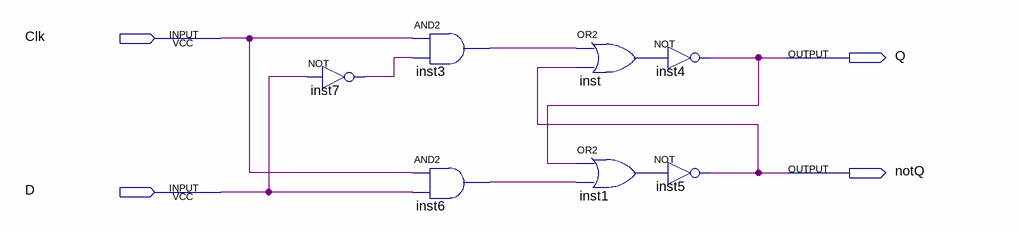
[diagram p0: schematic sheet]
// Quartus schematic DLatch1.bdf as structural Verilog: 7 symbols, 4 pins
module DLatch1 (
  input  Clk,
  input  D,
  output Q,
  output notQ
);

  wire inst1_out, inst3_out, inst6_out, inst7_out, inst_out;

  not inst7 (inst7_out, D);
  and inst3 (inst3_out, Clk, inst7_out);
  and inst6 (inst6_out, Clk, D);
  or inst (inst_out, inst3_out, notQ);
  or inst1 (inst1_out, Q, inst6_out);
  not inst4 (Q, inst_out);
  not inst5 (notQ, inst1_out);
endmodule
